# EAGLE design v1.4 (EAGLE 7.3.0)
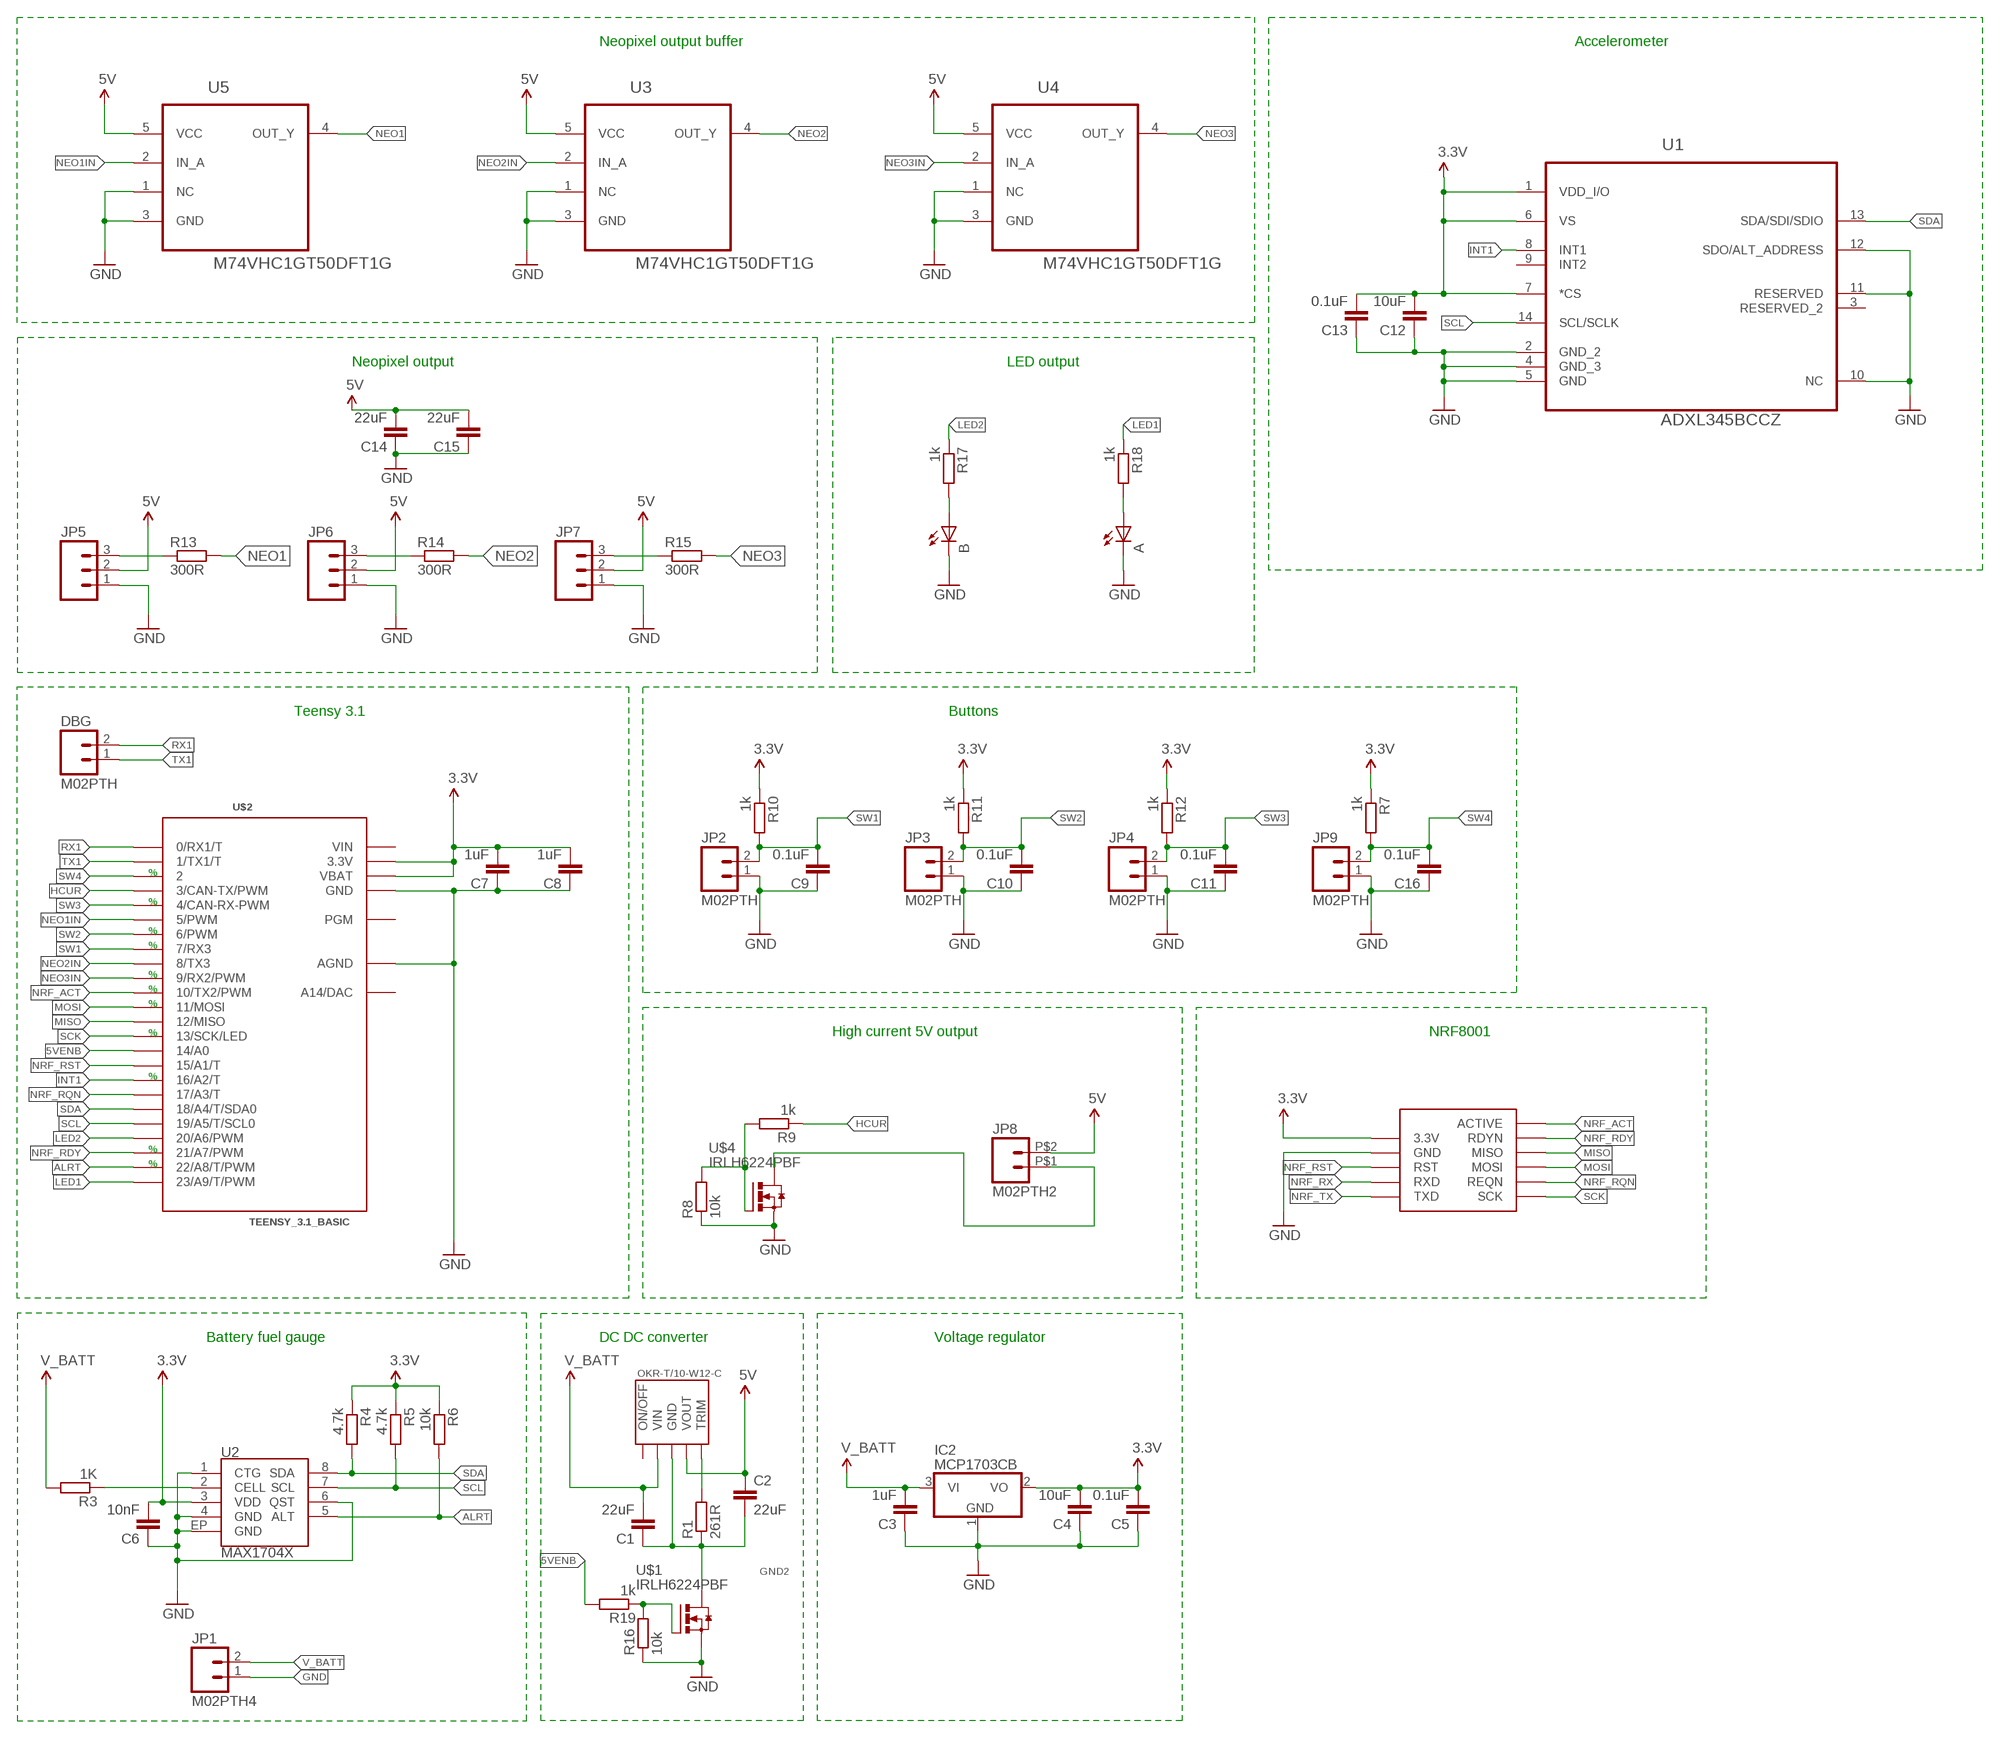
[diagram p0: schematic, sheet 1]

## Parts
A  LEDCHIPLED_0603  [CHIPLED_0603]
B  LEDCHIPLED_0603  [CHIPLED_0603]
C1  22uF  C-EUC0603  [C0603]
C2  22uF  C-EUC0603  [C0603]
C3  1uF  C-EUC0603  [C0603]
C4  10uF  C-EUC0603  [C0603]
C5  0.1uF  C-EUC0603  [C0603]
C6  10nF  C-EUC0603  [C0603]
C7  1uF  C-EUC0603  [C0603]
C8  1uF  C-EUC0603  [C0603]
C9  0.1uF  C-EUC0603  [C0603]
C10  0.1uF  C-EUC0603  [C0603]
C11  0.1uF  C-EUC0603  [C0603]
C12  10uF  C-EUC0603  [C0603]
C13  0.1uF  C-EUC0603  [C0603]
C14  22uF  C-EUC0603  [C0603]
C15  22uF  C-EUC0603  [C0603]
C16  0.1uF  C-EUC0603  [C0603]
DBG  M02PTH  [1X02]
IC2  MCP1703CB  [SOT23]
JP1  M02PTH4  [1X02_XTRA_BIG]
JP2  M02PTH  [1X02]
JP3  M02PTH  [1X02]
JP4  M02PTH  [1X02]
JP5  M03POLAR  [MOLEX-1X3]
JP6  M03POLAR  [MOLEX-1X3]
JP7  M03POLAR  [MOLEX-1X3]
JP8  M02PTH2  [1X02_BIG]
JP9  M02PTH  [1X02]
OKR-T/10-W12-C  OKR-T/10C90  [OKR-T/10C90]
R1  261R  R-EU_R0603  [R0603]
R3  1K  R-EU_R0603  [R0603]
R4  4.7k  R-EU_R0603  [R0603]
R5  4.7k  R-EU_R0603  [R0603]
R6  10k  R-EU_R0603  [R0603]
R7  1k  R-EU_R0603  [R0603]
R8  10k  R-EU_R0603  [R0603]
R9  1k  R-EU_R0603  [R0603]
R10  1k  R-EU_R0603  [R0603]
R11  1k  R-EU_R0603  [R0603]
R12  1k  R-EU_R0603  [R0603]
R13  300R  R-EU_R0603  [R0603]
R14  300R  R-EU_R0603  [R0603]
R15  300R  R-EU_R0603  [R0603]
R16  10k  R-EU_R0603  [R0603]
R17  1k  R-EU_R0603  [R0603]
R18  1k  R-EU_R0603  [R0603]
R19  1k  R-EU_R0603  [R0603]
U1  ADXL345BCCZ  [LGA14R80P3X6_300X500X100]
U2  MAX1704X  [TDFN-8]
U3  M74VHC1GT50DFT1G  [SOT65P210X110-5N]
U4  M74VHC1GT50DFT1G  [SOT65P210X110-5N]
U5  M74VHC1GT50DFT1G  [SOT65P210X110-5N]
U$1  IRLH6224PBF  [PQFN]
U$2  TEENSY_3.1_BASIC  [TEENSY_3.1_BASIC]
U$3  MOD-NRF8001  [MOD-NRF8001]
U$4  IRLH6224PBF  [PQFN]

## Nets
3.3V: C4.2 C5.2 C6.2 C7.2 C8.2 C12.2 C13.2 IC2.2(VO) R4.1 R5.1 R6.1 R7.1 R10.1 R11.1 R12.1 U1.1(VDD_I/O) U1.6(VS) U1.7(*CS) U2.3(VDD) U$2.3.3V U$2.3.3V1(3.3V) U$2.VBAT U$3.3.3V
5V: C2.1 C14.2 C15.2 JP5.2 JP6.2 JP7.2 JP8.P$2 OKR-T/10-W12-C.P$4(VOUT) U3.5(VCC) U4.5(VCC) U5.5(VCC)
5VENB: R19.2 U$2.14/A0
5VENB2: R16.2 R19.1 U$1.P$4(G)
ALRT: R6.2 U2.5(ALT) U$2.22/A8(22/A8/T/PWM)
GND: A.C B.C C3.1 C4.1 C5.1 C6.1 C7.1 C8.1 C9.1 C10.1 C11.1 C12.1 C13.1 C16.1 IC2.1(GND) JP1.1 JP2.1 JP3.1 JP4.1 JP9.1 R16.1 U1.2(GND_2) U1.4(GND_3) U1.5(GND) U1.10(NC) U1.11(RESERVED) U1.12(SDO/ALT_ADDRESS) U2.1(CTG) U2.4(GND) U2.6(QST) U2.EP(GND) U$1.P$1(S) U$1.P$2(S) U$1.P$3(S) U$2.AGND U$2.GND U$2.GND1(GND) U$3.GND
GND2: C1.1 C2.2 C14.1 C15.1 JP5.1 JP6.1 JP7.1 OKR-T/10-W12-C.P$3(GND) R1.1 R8.1 U3.1(NC) U3.3(GND) U4.1(NC) U4.3(GND) U5.1(NC) U5.3(GND) U$1.P$5(D) U$4.P$1(S) U$4.P$2(S) U$4.P$3(S) ; supply symbol labelled GND
HCUR: R9.1 U$2.3(3/CAN-TX/PWM)
INT1: U1.8(INT1) U$2.16/A2(16/A2/T)
LED: JP8.P$1 U$4.P$5(D)
LED1: R18.1 U$2.23/A9(23/A9/T/PWM)
LED2: R17.1 U$2.20/A6(20/A6/PWM)
MISO: U$2.12(12/MISO) U$3.MISO
MOSI: U$2.11(11/MOSI) U$3.MOSI
N$1: OKR-T/10-W12-C.P$5(TRIM) R1.2
N$4: R3.1 U2.2(CELL)
N$5: R8.2 R9.2 U$4.P$4(G)
N$12: JP5.3 R13.1
N$13: JP6.3 R14.1
N$14: JP7.3 R15.1
N$18: B.A R17.2
N$19: A.A R18.2
NEO1: R13.2 U5.4(OUT_Y)
NEO1IN: U5.2(IN_A) U$2.5(5/PWM)
NEO2: R14.2 U3.4(OUT_Y)
NEO2IN: U3.2(IN_A) U$2.8(8/TX3)
NEO3: R15.2 U4.4(OUT_Y)
NEO3IN: U4.2(IN_A) U$2.9(9/RX2/PWM)
NRF_ACT: U$2.10(10/TX2/PWM) U$3.ACTIVE
NRF_RDY: U$2.21/A7(21/A7/PWM) U$3.RDYN
NRF_RQN: U$2.17/A3(17/A3/T) U$3.REQN
NRF_RST: U$2.15/A1(15/A1/T) U$3.RST
NRF_RX: U$3.RXD
NRF_TX: U$3.TXD
RX1: DBG.2 U$2.0(0/RX1/T)
SCK: U$2.13(13/SCK/LED) U$3.SCK
SCL: R5.2 U1.14(SCL/SCLK) U2.7(SCL) U$2.19/A5(19/A5/T/SCL0)
SDA: R4.2 U1.13(SDA/SDI/SDIO) U2.8(SDA) U$2.18/A4(18/A4/T/SDA0)
SW1: C9.2 JP2.2 R10.2 U$2.7(7/RX3)
SW2: C10.2 JP3.2 R11.2 U$2.6(6/PWM)
SW3: C11.2 JP4.2 R12.2 U$2.4(4/CAN-RX-PWM)
SW4: C16.2 JP9.2 R7.2 U$2.2
TX1: DBG.1 U$2.1(1/TX1/T)
V_BATT: C1.2 C3.2 IC2.3(VI) JP1.2 OKR-T/10-W12-C.P$2(VIN) R3.2
Unconnected: OKR-T/10-W12-C.P$1(ON/OFF) U1.3(RESERVED_2) U1.9(INT2) U$2.A14(A14/DAC) U$2.PGM

## Notes on the sheet
- Neopixel output buffer | Accelerometer
- Neopixel output | LED output
- Teensy 3.1 | Buttons
- %
- %
- %
- %
- %
- %
- %
- % | High current 5V output | NRF8001
- %
- %
- %
- Battery fuel gauge | DC DC converter | Voltage regulator

## Power pins joined to a net without a drawn wire
VIN: U$2.VIN

## Library data of the parts
A B = led:LED: LED OSRAM: - CHIPLED LG R971, LG N971, LY N971, LG Q971, LY Q971, LO R971, LY R971 LH N974, LH R974 LS Q976, LO Q976, LY Q976 LO Q996 - Hyper CHIPLED LW Q18S LB Q993, LB Q99A, LB R99A - SideLED LS A670, LO A670, LY A670, LG A670, LP A670 LB A673, LV A673, LT A673, LW A673 LH A674 LY A675 LS A676, LA A676, LO A676, LY A676, LW A676 LS A679, LY A679, LG A679 - Hyper Micro SIDELED® LS Y876, LA Y876, LO Y876, LY Y876 LT Y87S - SmartLED LW L88C, LW L88S LB L89C, LB L89S, LG L890 LS L89K, LO L89K, LY L89K LS L896, LA L896, LO L896, LY L896 - TOPLED LS T670, LO T670, LY T670, LG T670, LP T670 LSG T670, LSP T670, LSY T670, LOP T670, LYG T670 LG T671, LOG T671, LSG T671 LB T673, LV T673, LT T673, LW T673 LH T674 LS T676, LA T676, LO T676, LY T676, LB T676, LH T676, LSB T676, LW T676 LB T67C, LV T67C, LT T67C, LS T67K, LO T67K, LY T67K, LW E67C LS E67B, LA E67B, LO E67B, LY E67B, LB E67C, LV E67C, LT E67C LW T67C LS T679, LY T679, LG T679 LS T770, LO T770, LY T770, LG T770, LP T770 LB T773, LV T773, LT T773, LW T773 LH T774 LS E675, LA E675, LY E675, LS T675 LS T776, LA T776, LO T776, LY T776, LB T776 LHGB T686 LT T68C, LB T68C - Hyper Mini TOPLED® LB M676 - Mini TOPLED Santana® LG M470 LS M47K, LO M47K, LY M47K Source: http://www.osram.convergy.de LUXEON: - LUMILED® LXK2-PW12-R00, LXK2-PW12-S00, LXK2-PW14-U00, LXK2-PW14-V00 LXK2-PM12-R00, LXK2-PM12-S00, LXK2-PM14-U00 LXK2-PE12-Q00, LXK2-PE12-R00, LXK2-PE12-S00, LXK2-PE14-T00, LXK2-PE14-U00 LXK2-PB12-K00, LXK2-PB12-L00, LXK2-PB12-M00, LXK2-PB14-N00, LXK2-PB14-P00, LXK2-PB14-Q00 LXK2-PR12-L00, LXK2-PR12-M00, LXK2-PR14-Q00, LXK2-PR14-R00 LXK2-PD12-Q00, LXK2-PD12-R00, LXK2-PD12-S00 LXK2-PH12-R00, LXK2-PH12-S00 LXK2-PL12-P00, LXK2-PL12-Q00, LXK2-PL12-R00 Source: www.luxeon.com KINGBRIGHT: KA-3528ASYC Source: www.kingbright.com
C1-C16 = rcl:C-EU: CAPACITOR, European symbol
DBG JP1-JP4 JP8 JP9 = SparkFun-Connectors:M02: Standard 2-pin 0.1" header. Use with - straight break away headers ( PRT-00116) - right angle break away headers (PRT-00553) - swiss pins (PRT-00743) - machine pins (PRT-00117) - female headers (PRT-00115) Molex polarized connector foot print use with: PRT-08233 with associated crimp pins and housings. 2.54_SCREWTERM for use with PRT-10571. 3.5mm Screw Terminal footprints for PRT-08084 5mm Screw Terminal footprints for use with PRT-08433
IC2 = linear:MCP1703: 250 mA, 16V, Low Quiescent Current LDO Regulator Source: http://ww1.microchip.com/downloads/en/DeviceDoc/22049b.pdf
JP5-JP7 = SparkFun-Connectors:M03: Header 3 Standard 3-pin 0.1" header. Use with straight break away headers (SKU : PRT-00116), right angle break away headers (PRT-00553), swiss pins (PRT-00743), machine pins (PRT-00117), and female headers (PRT-00115). Molex polarized connector foot print use with SKU : PRT-08232 with associated crimp pins and housings.
OKR-T/10-W12-C = Steve:OKR-T/10C90
R1 R3-R19 = rcl:R-EU_: RESISTOR, European symbol
U1 = Steve:ADXL345BCCZ: IC, ACCELEROMETER, 3AXIS; MPN: ADXL345BCCZ; OC_FARNELL: 1853935; OC_NEWARK: 04R8114; PACKAGE: 14-Terminal Land Grid Array [LGA]; SUPPLIER: Analog Devices
U2 = SparkFun:MAX1704X: MAX17043/MAX17044: Battery Fuel Guage (43 is 1cell, 44 is 2cell)
U3-U5 = Steve:M74VHC1GT50DFT1G: Noninverting Buffer / CMOS Logic Level Shifter; MPN: M74VHC1GT50DFT1G; OC_FARNELL: 1703292; OC_NEWARK: 61K1043; PACKAGE: SOT-5; SUPPLIER: ON Semiconductor
U$1 U$4 = Steve:IRLH6224PBF: HEXFET Power MOSFET - PWFN 5X6mm
U$2 = Teensy_3_Series_Board_v1.0:TEENSY_3.1_BASIC: Footprint for Teensy 3.1 board using all pin connections on the outer perimeter
U$3 = Steve:MOD-NRF8001

## Board
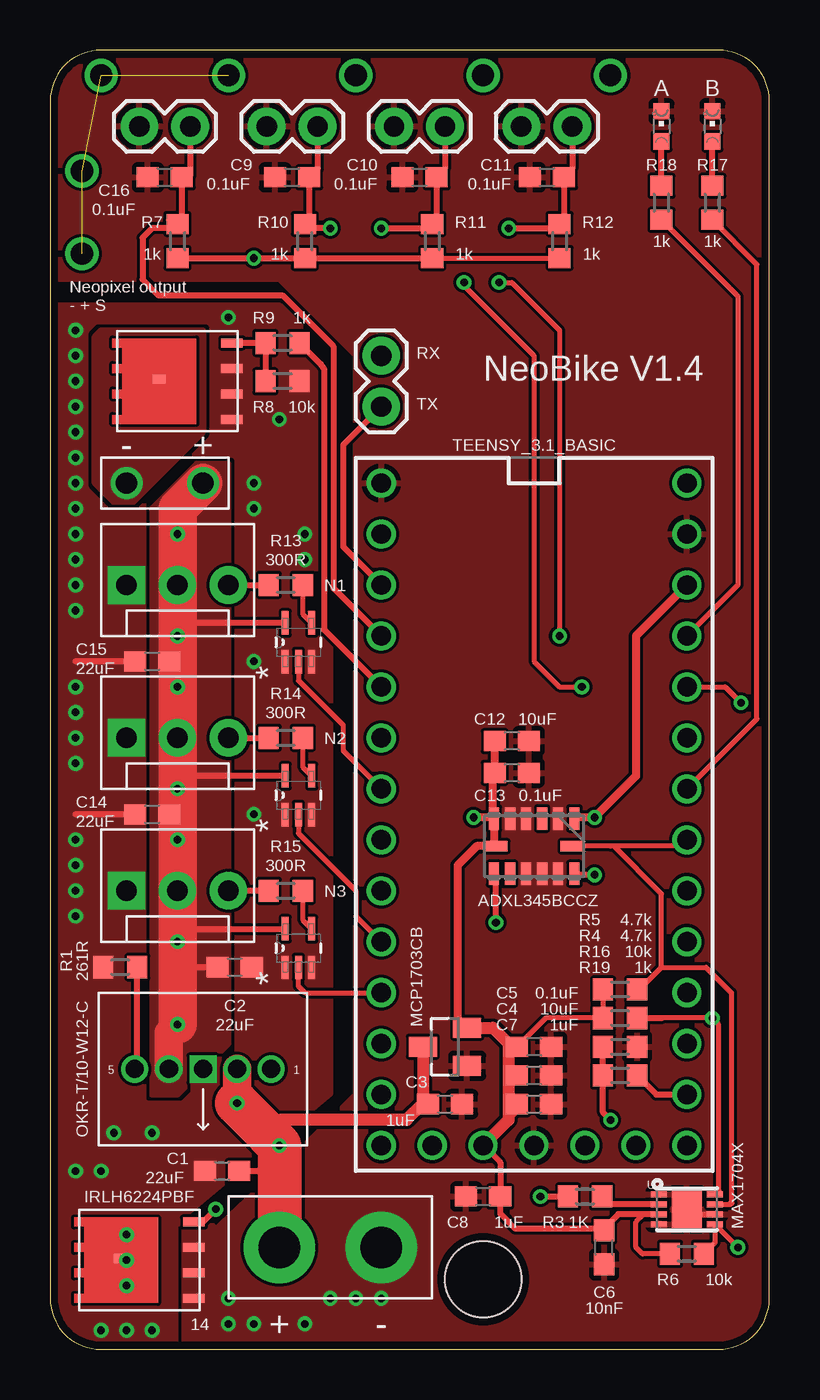
[diagram p1: board, top side]
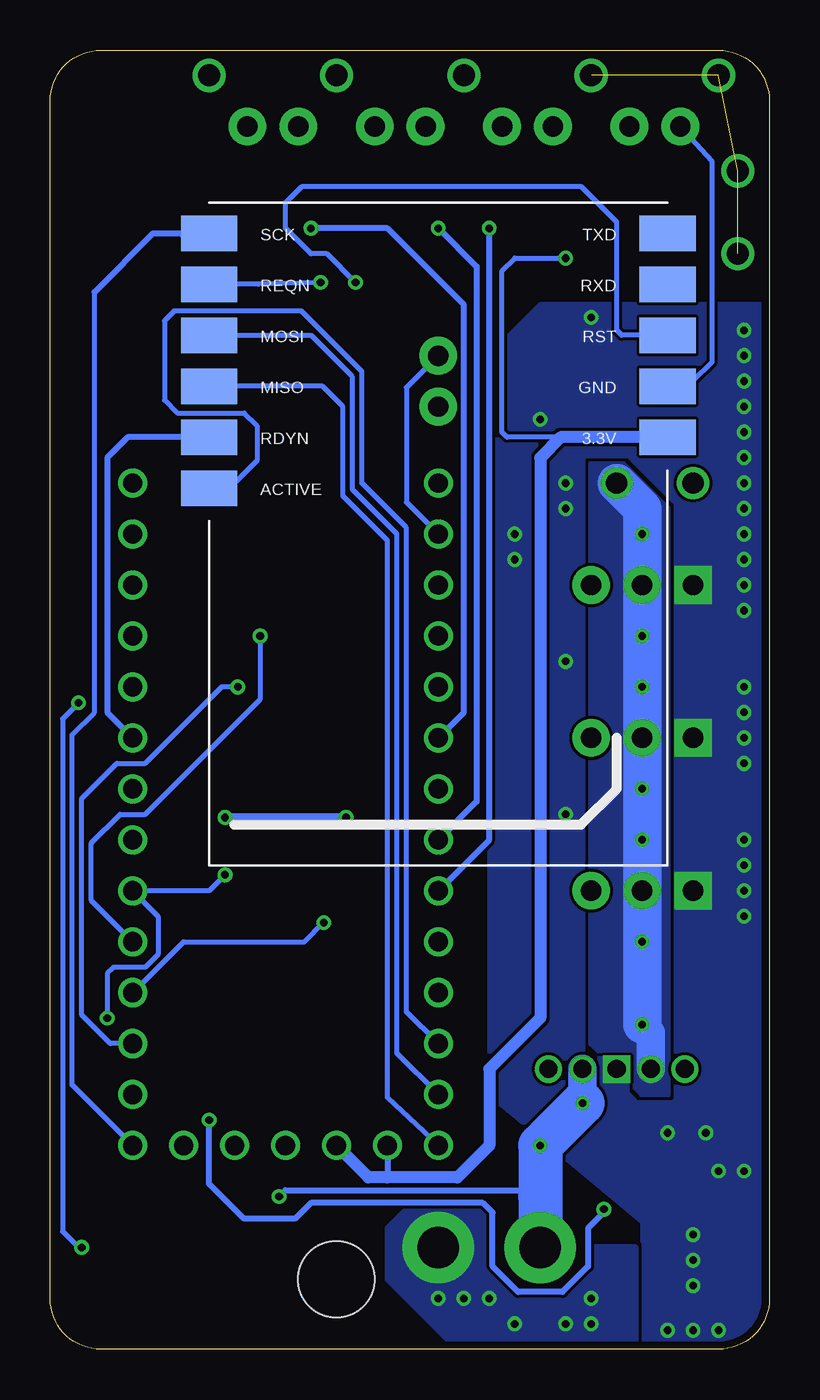
[diagram p2: board, bottom side, seen from below]

Size 35.87 x 64.76 mm. Coordinates in mm from the lower left corner, seen from the top.
Outline: 0,62.22 0,2.54 arc90 2.54,0 33.33,0 arc90 35.87,2.54 35.87,62.22 arc90 33.33,64.76 2.54,64.76 arc90 0,62.22
Copper layers (1*16): Top 0.0356mm / dielectric 1.5011mm / Bottom 0.0356mm
Design rules "LaenPCBOrder": minimum track width 6mil, minimum drill 13mil, track to track 6mil, track to pad 6mil, pad to pad 6mil, via to via 6mil, smd to smd 6mil, copper to edge 15mil, drill to drill 6mil, minimum pad ring 7mil, minimum via ring 7mil, stop-mask expansion 3mil, vias tented up to drill 0mil, thermal gap 10mil
Holes 3.81 mm at 21.59,3.49

### Footprints (pad centres in the part's own frame; a part is rotated, then mirrored left to right if it is on the bottom)
CHIPLED_0603 = smd 0.8 x 0.8: A 0,-0.75; C 0,0.75
C0603 = smd 1.1 x 1: 1 -0.85,0; 2 0.85,0
1X02 = drill 1.016 pad 1.88: 1 0,0; 2 2.54,0
SOT23 = smd 1 x 1.4: 1 -0.95,-1.1; 2 0.95,-1.1; 3 0,1.1
1X02_XTRA_BIG = drill 2.057 pad 3.556: 1 -2.54,0; 2 2.54,0
MOLEX-1X3 = drill 1.016 pad 1.88 square: 1 0,0 | drill 1.016 pad 1.88: 2 2.54,0; 3 5.08,0
1X02_BIG = drill 1.067: P$1 0,0; P$2 3.81,0
OKR-T/10C90 = drill 0.9: P$1 3.4,0; P$2 1.7,0; P$4 -1.7,0; P$5 -3.4,0 | drill 0.9 square: P$3 0,0
R0603 = smd 1 x 1.1: 1 -0.85,0; 2 0.85,0
LGA14R80P3X6_300X500X100 = smd 1.118 x 0.508: 1 -1.372,2.007; 2 -1.372,1.194; 3 -1.372,0.406; 4 -1.372,-0.406; 5 -1.372,-1.194; 6 -1.372,-2.007; 8 1.372,-2.007; 9 1.372,-1.194; 10 1.372,-0.406; 11 1.372,0.406; 12 1.372,1.194; 13 1.372,2.007 | smd 0.508 x 1.118: 7 0,-1.88; 14 0,1.88
TDFN-8 = smd 0.8 x 0.3: 1 -1.4,0.75; 2 -1.4,0.25; 3 -1.4,-0.25; 4 -1.4,-0.75; 5 1.4,-0.75; 6 1.4,-0.25; 7 1.4,0.25; 8 1.4,0.75 | smd 1.5 x 1.88: EP 0,0
SOT65P210X110-5N = smd 1.168 x 0.356: 1 -0.965,0.66; 2 -0.965,0; 3 -0.965,-0.66; 4 0.965,-0.66; 5 0.965,0.66
PQFN = smd 1.08 x 0.45: P$1 -2.717,1.905; P$2 -2.717,0.635; P$3 -2.717,-0.635; P$4 -2.717,-1.905 | smd 0.65 x 0.45: P$5 0.922,-0.095
TEENSY_3.1_BASIC = drill 0.965: 0 -7.62,13.97; 1 -7.62,11.43; 2 -7.62,8.89; 3 -7.62,6.35; 3.3V 7.62,11.43; 3.3V1 -2.54,-16.51; 4 -7.62,3.81; 5 -7.62,1.27; 6 -7.62,-1.27; 7 -7.62,-3.81; 8 -7.62,-6.35; 9 -7.62,-8.89; 10 -7.62,-11.43; 11 -7.62,-13.97; 12 -7.62,-16.51; 13 7.62,-16.51; 14/A0 7.62,-13.97; 15/A1 7.62,-11.43; 16/A2 7.62,-8.89; 17/A3 7.62,-6.35; 18/A4 7.62,-3.81; 19/A5 7.62,-1.27; 20/A6 7.62,1.27; 21/A7 7.62,3.81; 22/A8 7.62,6.35; 23/A9 7.62,8.89; A14 5.08,-16.51; AGND 7.62,13.97; GND -7.62,16.51; GND1 0,-16.51; PGM 2.54,-16.51; VBAT -5.08,-16.51; VIN 7.62,16.51
MOD-NRF8001 = smd 1.778 x 2.794: 3.3V 4.826,-11.43; ACTIVE 2.286,11.43; GND 7.366,-11.43; MISO 7.366,11.43; MOSI 9.906,11.43; RDYN 4.826,11.43; REQN 12.446,11.43; RST 9.906,-11.43; RXD 12.446,-11.43; SCK 14.986,11.43; TXD 14.986,-11.43

### Placement (x,y rotation side)
A  30.48,60.96 0 top
B  33.02,60.96 0 top
C1  8.57,8.89 0 top
C2  9.21,19.05 0 top
C3  19.68,12.22 180 top
C4  24.13,13.65 180 top
C5  24.13,15.08 180 top
C6  27.62,5.08 90 top
C7  24.13,12.22 180 top
C8  21.59,7.62 0 top
C9  12.06,58.42 0 top
C10  18.41,58.42 0 top
C11  24.77,58.42 0 top
C12  23.02,30.32 180 top
C13  23.02,28.73 180 top
C14  5.08,26.67 0 top
C15  5.08,34.29 0 top
C16  5.71,58.42 0 top
DBG  16.51,46.99 90 top
IC2  19.68,15.08 90 top
JP1  13.97,5.08 180 top
JP2  10.79,60.96 0 top
JP3  17.14,60.96 0 top
JP4  23.5,60.96 0 top
JP5  3.81,38.1 0 top
JP6  3.81,30.48 0 top
JP7  3.81,22.86 0 top
JP8  3.81,43.18 0 top
JP9  4.45,60.96 0 top
OKR-T/10-W12-C  7.62,13.97 0 top
R1  3.49,19.05 0 top
R3  26.67,7.62 180 top
R4  28.42,16.51 0 top
R5  28.42,17.94 0 top
R6  31.75,4.76 0 top
R7  6.35,55.24 90 top
R8  11.59,48.26 180 top
R9  11.59,50.16 180 top
R10  12.7,55.24 90 top
R11  19.05,55.24 90 top
R12  25.4,55.24 90 top
R13  11.75,38.1 0 top
R14  11.75,30.48 0 top
R15  11.75,22.86 0 top
R16  28.42,15.08 180 top
R17  33.02,57.15 90 top
R18  30.48,57.15 90 top
R19  28.42,13.65 0 top
U1  24.13,25.08 270 top
U2  31.75,6.99 0 top
U3  12.38,27.62 90 top
U4  12.38,20 90 top
U5  12.38,35.24 90 top
U$1  4.45,4.45 180 top
U$2  24.13,26.67 0 top
U$3  16.51,40.64 90 bottom
U$4  6.35,48.26 180 top

### Tracks (layer width: path | path; a pad name or v marks a point on that pad's centre or on a via)
3.3V  (via drill 0.38)
  Top 0.254: R11.1 R12.1 | R5.1 R4.1 24.71,16.51 C5.2 23.02,15.08 22.86,15.24 | C6.2 27.62,6.03 | U2.3 29.59,6.74 29.21,6.35 29.21,5.08 29.53,4.76 R6.1 | 22.07,28.42 22.07,28.63 C13.2 | C7.2 23.28,11.85 22.86,11.43
  Top 0.305: R10.1 R11.1 | R10.1 18.63,54.4 | U$2.3.3V1 22.44,9.31 C8.2 22.44,6.77 23.18,6.03 27.62,6.03 28.32,6.74 U2.3 | R7.1 v10.16,54.4 R10.1 | C4.2 22.86,13.97 | 22.07,26.51 U1.6
  Top 0.406: 22.07,28.42 22.07,26.51 v21.11,26.51 | C13.2 C12.2 | U1.6 22.12,25.21 U1.7 21.27,25.08 20.32,24.13 20.32,16.5 IC2.2 | U1.1 26.19,26.51 v27.15,26.51 29.21,28.57 29.21,35.56 U$2.3.3V
  Top 0.61: IC2.2 22.07,16.03 22.86,15.24 22.86,13.97 22.86,11.43 U$2.3.3V1
  Bottom 0.254: 10.41,45.47 13.08,45.47 13.34,45.72 13.34,53.76 R10.1 v10.16,54.4
  Bottom 0.305: U$2.VBAT 19.05,8.57
  Bottom 0.406: v21.11,26.51 v27.15,26.51
  Bottom 0.61: U$3.3.3V 10.41,45.47 11.43,44.45 11.43,16.51 13.97,13.97 13.97,10.16 15.56,8.57 19.05,8.57 20,8.57 U$2.3.3V1
5V  (via drill 0.38)
  Top 0.305: C2.1 6.35,19.05 | 6.35,29.21 6.97,28.59 U3.5 | v6.35,35.56 7,36.21 U5.5 | U4.5 11.71,20.95 6.99,20.95 v6.35,20.32 | C15.2 6.35,34.29 | C14.2 5.93,27.52 v6.35,27.94
  Top 1.422: OKR-T/10-W12-C.P$4 5.92,15.76 v6.35,16.19
  Top 1.93: v6.35,16.19 6.35,19.05 v6.35,20.32 JP7.2 v6.35,25.4 v6.35,27.94 6.35,29.21 JP6.2 v6.35,33.02 6.35,34.29 v6.35,35.56 JP5.2 v6.35,40.64 6.35,41.91 JP8.P$2
  Bottom 1.422: OKR-T/10-W12-C.P$4 5.92,15.76
  Bottom 1.93: v6.35,16.19 6.35,41.91 JP8.P$2
  pour Bottom (no thermals): 5.08,41.91 5.08,12.7 6.35,12.7 8.89,15.24 8.89,44.13 7.3,44.13
  pour Top (rank 2, no thermals): 5.08,41.91 5.08,12.7 6.35,12.7 8.89,15.24 8.89,44.13 7.3,44.13
5VENB
  Top 0.305: R19.2 30.22,12.7 U$2.14/A0
5VENB2  (via drill 0.38)
  Top 0.305: U$1.P$4 7.62,6.35 v8.26,6.99 | R16.2 R19.1 27.57,11.8 v27.94,11.43
  Bottom 0.305: v27.94,11.43 27.94,8.26 26.19,6.51 23.65,6.51 22.86,7.3 14.29,7.3 13.81,6.83 13.81,4.13 12.54,2.86 10.32,2.86 9.05,4.13 9.05,6.03 8.26,6.83 v8.26,6.99
ALRT  (via drill 0.38)
  Top 0.254: v34.29,5.08 34.29,5.09 U2.5 33.15,5.31 R6.2 | U$2.22/A8 33.66,33.02 v34.45,32.23
  Bottom 0.254: v34.29,5.08 34.45,5.08 35.24,5.87 35.24,31.43 v34.45,32.23
GND  (via drill 0.38)
  Top 0.305: U2.EP 32,6.74 U2.6
  Bottom 0.254: 5.33,48.01 U$3.GND 4.83,48.26 3.81,48.26 2.86,49.21 2.86,59.21 JP9.1
  other vias: 8.89,2.54 8.89,1.27 10.16,1.27 12.7,1.27 15.24,2.54 16.51,2.54 13.97,2.54
  pour Top: -1.27,66.04 36.83,66.04 36.83,-1.27 7.3,-1.27 7.3,5.08 12.7,10.16 15.24,12.7 15.24,49.53 11.43,53.34 -1.27,53.34
  pour Top (no thermals): 6.67,6.67 6.67,0 8.89,0 8.89,5.4 7.62,6.67
  pour Top (rank 2, no thermals): 13.97,6.35 15.24,7.62 17.78,7.62 19.05,6.35 19.05,3.81 17.78,2.54 15.24,2.54 13.97,3.81
  pour Bottom (no thermals): 6.67,5.08 8.89,5.08 8.89,3.81 10.16,2.54 12.7,2.54 13.97,3.81 13.97,6.67 14.61,7.3 17.78,7.3 19.05,6.03 19.05,3.49 15.88,0.32 6.67,0.32
  pour Top (no thermals): 20.95,27.62 27.46,27.62 27.46,22.7 20.95,22.7
GND2  (via drill 0.38)
  Top 0.305: C14.1 1.27,26.67 | C15.1 1.27,34.29
  other vias: 2.54,8.89 1.27,8.89 5.08,10.79 2.54,0.95 1.27,25.4 1.27,24.13 1.27,22.86 1.27,21.59 1.27,33.02 1.27,31.75 1.27,30.48 1.27,29.21 1.27,40.64 1.27,39.37 1.27,38.1 1.27,36.83 3.17,10.79 10.16,34.29 10.16,26.67 5.08,0.95 3.81,0.95 3.81,5.71 3.81,4.45 3.81,3.17 10.16,41.91 10.16,43.18 1.27,44.45 1.27,45.72 1.27,46.99 1.27,48.26 1.27,49.53 1.27,50.8 11.43,46.35 12.7,40.64 12.7,39.37 8.89,51.44 1.27,43.18 1.27,41.91
  pour Top (rank 3, no thermals): -1.27,52.07 11.43,52.07 13.97,49.53 13.97,12.7 6.35,6.35 6.35,-1.27 -1.27,-1.27
  pour Bottom (rank 2, no thermals): -1.27,52.07 11.43,52.07 13.97,49.53 13.97,12.7 6.35,6.35 6.35,-1.27 -1.27,-1.27
HCUR
  Top 0.305: U$2.3 13.65,35.88 13.65,48.9 13.49,49.11 R9.1
INT1  (via drill 0.38)
  Top 0.305: v22.23,21.27 22.23,23.61 U1.8
  Bottom 0.254: U$2.16/A2 29.21,20.32 23.18,20.32 v22.23,21.27
LED
  pour Top (no thermals): 2.54,50.8 7.62,50.8 7.62,45.72 4.13,42.23 3.17,42.23 2.22,43.18 2.22,50.48
LED1
  Top 0.254: R18.1 34.29,52.49 34.29,38.1 U$2.23/A9
LED2
  Top 0.254: R17.1 35.24,54.08 35.24,31.43 U$2.20/A6
MISO
  Bottom 0.254: 27.94,48.26 U$3.MISO 22.29,48.01 21.27,46.99 21.27,42.55 19.05,40.32 19.05,12.54 U$2.12
MOSI
  Bottom 0.254: U$3.MOSI 22.86,50.55 20.8,48.48 20.8,42.86 18.57,40.64 18.57,14.76 U$2.11
N$1
  Top 0.305: 4.22,18.93 R1.2 4.34,14.09 OKR-T/10-W12-C.P$5
N$4
  Top 0.305: U2.2 27.91,7.24 R3.1 27.52,7.87
N$5
  Top 0.305: U$4.P$4 R9.2 R8.2
N$6  (via drill 1.1)
  other vias: 15.24,63.5
N$7  (via drill 1.1)
  other vias: 21.59,63.5
N$8  (via drill 1.1)  (3 unrouted)
  other vias: 8.89,63.5 2.54,63.5 1.59,58.74 1.59,54.61
N$9  (via drill 1.1)
  other vias: 27.94,63.5
N$12
  Top 0.305: JP5.3 R13.1
N$13
  Top 0.305: JP6.3 R14.1
N$14
  Top 0.305: R15.1 JP7.3
N$18
  Top 0.305: R17.2 B.A
N$19
  Top 0.305: R18.2 A.A
NEO1
  Top 0.254: R13.2 12.6,36.65 U5.4
NEO1IN
  Top 0.254: U5.2 12.38,33.34 14.61,31.11 14.61,29.84 U$2.5
NEO2
  Top 0.254: R14.2 12.6,29.03 U3.4
NEO2IN
  Top 0.254: U3.2 12.38,25.72 15.24,22.86 15.24,21.59 U$2.8
NEO3
  Top 0.254: R15.2 12.6,21.41 U4.4
NEO3IN
  Top 0.254: U4.2 12.38,18.1 12.7,17.78 U$2.9
NRF_ACT
  Bottom 0.254: 27.88,42.86 U$3.ACTIVE 26.92,42.93 25.56,44.29 25.56,46.04 26.19,46.67 29.53,46.67 30.16,47.31 30.16,51.28 29.69,51.75 23.34,51.75 20.32,48.74 20.32,43.18 18.1,40.96 18.1,16.83 U$2.10
NRF_RDY
  Bottom 0.305: U$3.RDYN 32,45.47 33.02,44.45 33.02,31.75 U$2.21/A7
NRF_RQN  (via drill 0.38)
  Top 0.254: v22.38,53.18 23.02,53.18 25.4,50.8 v25.4,35.56
  Bottom 0.254: U$2.17/A3 33.81,22.38 33.81,25.24 32.38,26.67 31.11,26.67 25.4,32.38 v25.4,35.56 | v22.38,53.18 25.5,53.09 U$3.REQN
NRF_RST  (via drill 0.38)
  Top 0.254: v26.51,33.02 25.4,33.02 24.13,34.29 24.13,49.53 20.64,53.02 v20.64,53.18
  Bottom 0.254: U$3.RST 7.37,50.55 7.62,50.8 7.62,56.2 9.37,57.94 23.34,57.94 24.13,57.15 24.13,55.88 22.86,54.61 22.07,54.61 v20.64,53.18 | U$2.15/A1 32.86,15.24 34.29,16.67 34.29,27.46 32.54,29.21 31.11,29.21 27.3,33.02 v26.51,33.02
RX1
  Bottom 0.254: DBG.2 18.1,47.94 18.1,42.23 U$2.0
SCK
  Bottom 0.254: 29.27,55.56 27.62,55.56 | 26.67,55.88 27.69,55.88 U$3.SCK | U$2.13 34.77,13.18 34.77,30.64 33.66,31.75 33.66,52.7
  Bottom 0.305: 29.27,55.56 U$3.SCK 30.73,55.63 33.66,52.7
SCL
  Top 0.254: 33.97,7.3 33.97,17.78 32.7,19.05 30.48,19.05 | U2.7 33.91,7.24 | R5.2 29.37,17.94 30.48,19.05 | 30.48,19.05 30.48,22.7 28.1,25.08 | 28.1,25.08 27.94,25.08 U1.14 | U$2.19/A5 31.43,25.08 28.1,25.08
  Top 0.305: 33.91,7.24 33.97,7.3
SDA  (via drill 0.38)
  Top 0.254: 33.34,7.92 33.34,16.19 v33.02,16.51 30.48,16.51
  Top 0.305: U2.8 33.34,7.92 | R4.2 30.48,16.51 | v27.15,23.65 26.19,23.65 U1.13
  Bottom 0.254: v27.15,23.65 27.94,22.86 U$2.18/A4 30.48,21.59 30.48,19.68 31.11,19.05 32.7,19.05 33.02,18.73 v33.02,16.51
SW1  (via drill 0.38)
  Top 0.305: JP2.2 13.34,58.84 C9.2 12.91,56.31 R10.2 12.91,55.88 v13.97,55.88
  Bottom 0.305: v13.97,55.88 13.97,25.4 U$2.7
SW2  (via drill 0.38)
  Top 0.305: JP3.2 19.68,58.84 C10.2 19.27,56.31 R11.2 18.84,55.88 v16.51,55.88
  Bottom 0.305: v16.51,55.88 14.61,53.98 14.61,27.3 U$2.6
SW3  (via drill 0.38)
  Top 0.305: JP4.2 26.04,58.84 C11.2 25.61,56.31 R12.2 25.18,55.88 v22.86,55.88
  Bottom 0.305: U$2.4 15.24,31.75 15.24,52.07 19.05,55.88 v22.86,55.88
SW4
  Top 0.305: JP9.2 6.99,58.52 C16.2 6.57,56.31 R7.2 | 5.93,56.31 R7.2 | R7.2 6.13,55.88 5.08,55.88 4.6,55.4 4.6,53.34 5.4,52.55 11.59,52.55 14.13,50.01 14.13,37.94 U$2.2
TX1
  Top 0.305: U$2.1 14.61,40.01 14.61,45.09 DBG.1
V_BATT  (via drill 0.38)
  Top 0.254: C3.2 18.84,12.45 18.59,12.7
  Top 0.305: C1.2 11.43,8.89 | 9.75,12.7 v9.32,12.27 | v24.45,7.62 R3.2
  Top 0.61: IC2.3 18.59,12.7 18.59,12.23 17.78,11.43 11.43,11.43 10.79,10.79
  Top 1.422: OKR-T/10-W12-C.P$2 v9.32,12.27
  Top 2.184: JP1.2 11.43,8.89 v11.43,10.16 10.79,10.79 v9.32,12.27
  Bottom 0.305: v24.45,7.62 24.13,7.94 11.75,7.94 11.43,7.62
  Bottom 1.422: OKR-T/10-W12-C.P$2 v9.32,12.27
  Bottom 2.184: JP1.2 11.43,7.62 v11.43,10.16 v9.32,12.27

### Text on the board
_tsilk: Neopixel output / - + S | RX | NeoBike V1.4 | TX | - | + | N1 | N2 | N3 | OKR-T/10-W12-C | IRLH6224PBF | 14 | + | -